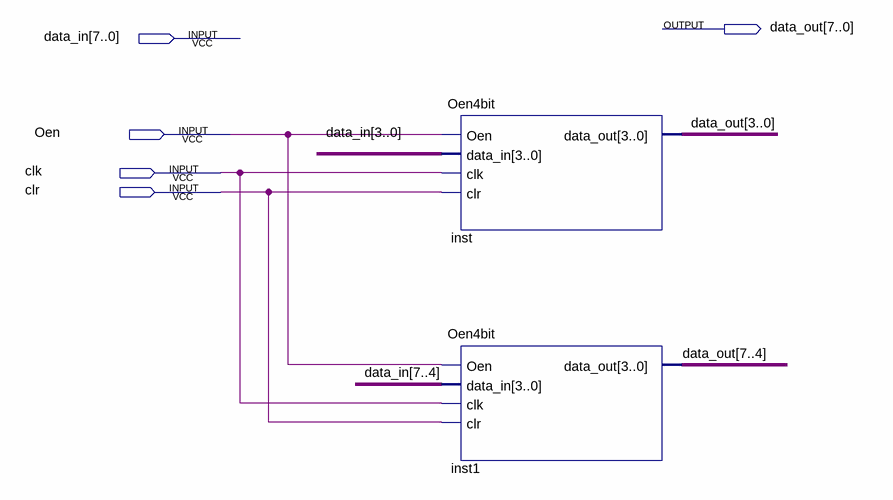
[diagram p0: schematic sheet]
// Quartus schematic Oen8bit.bdf as structural Verilog: 2 symbols, 5 pins
module Oen8bit (
  input  [7:0] data_in,
  input  Oen,
  input  clk,
  input  clr,
  output [7:0] data_out
);

  Oen4bit inst (.Oen(Oen), .data_in(data_in[3:0]), .clk(clk), .clr(clr), .data_out(data_out[3:0]));
  Oen4bit inst1 (.Oen(Oen), .data_in(data_in[7:4]), .clk(clk), .clr(clr), .data_out(data_out[7:4]));
endmodule
